# EAGLE design CCM_0020_revC (EAGLE 9.5.1)

## Sheet 1 of 4: transmitter
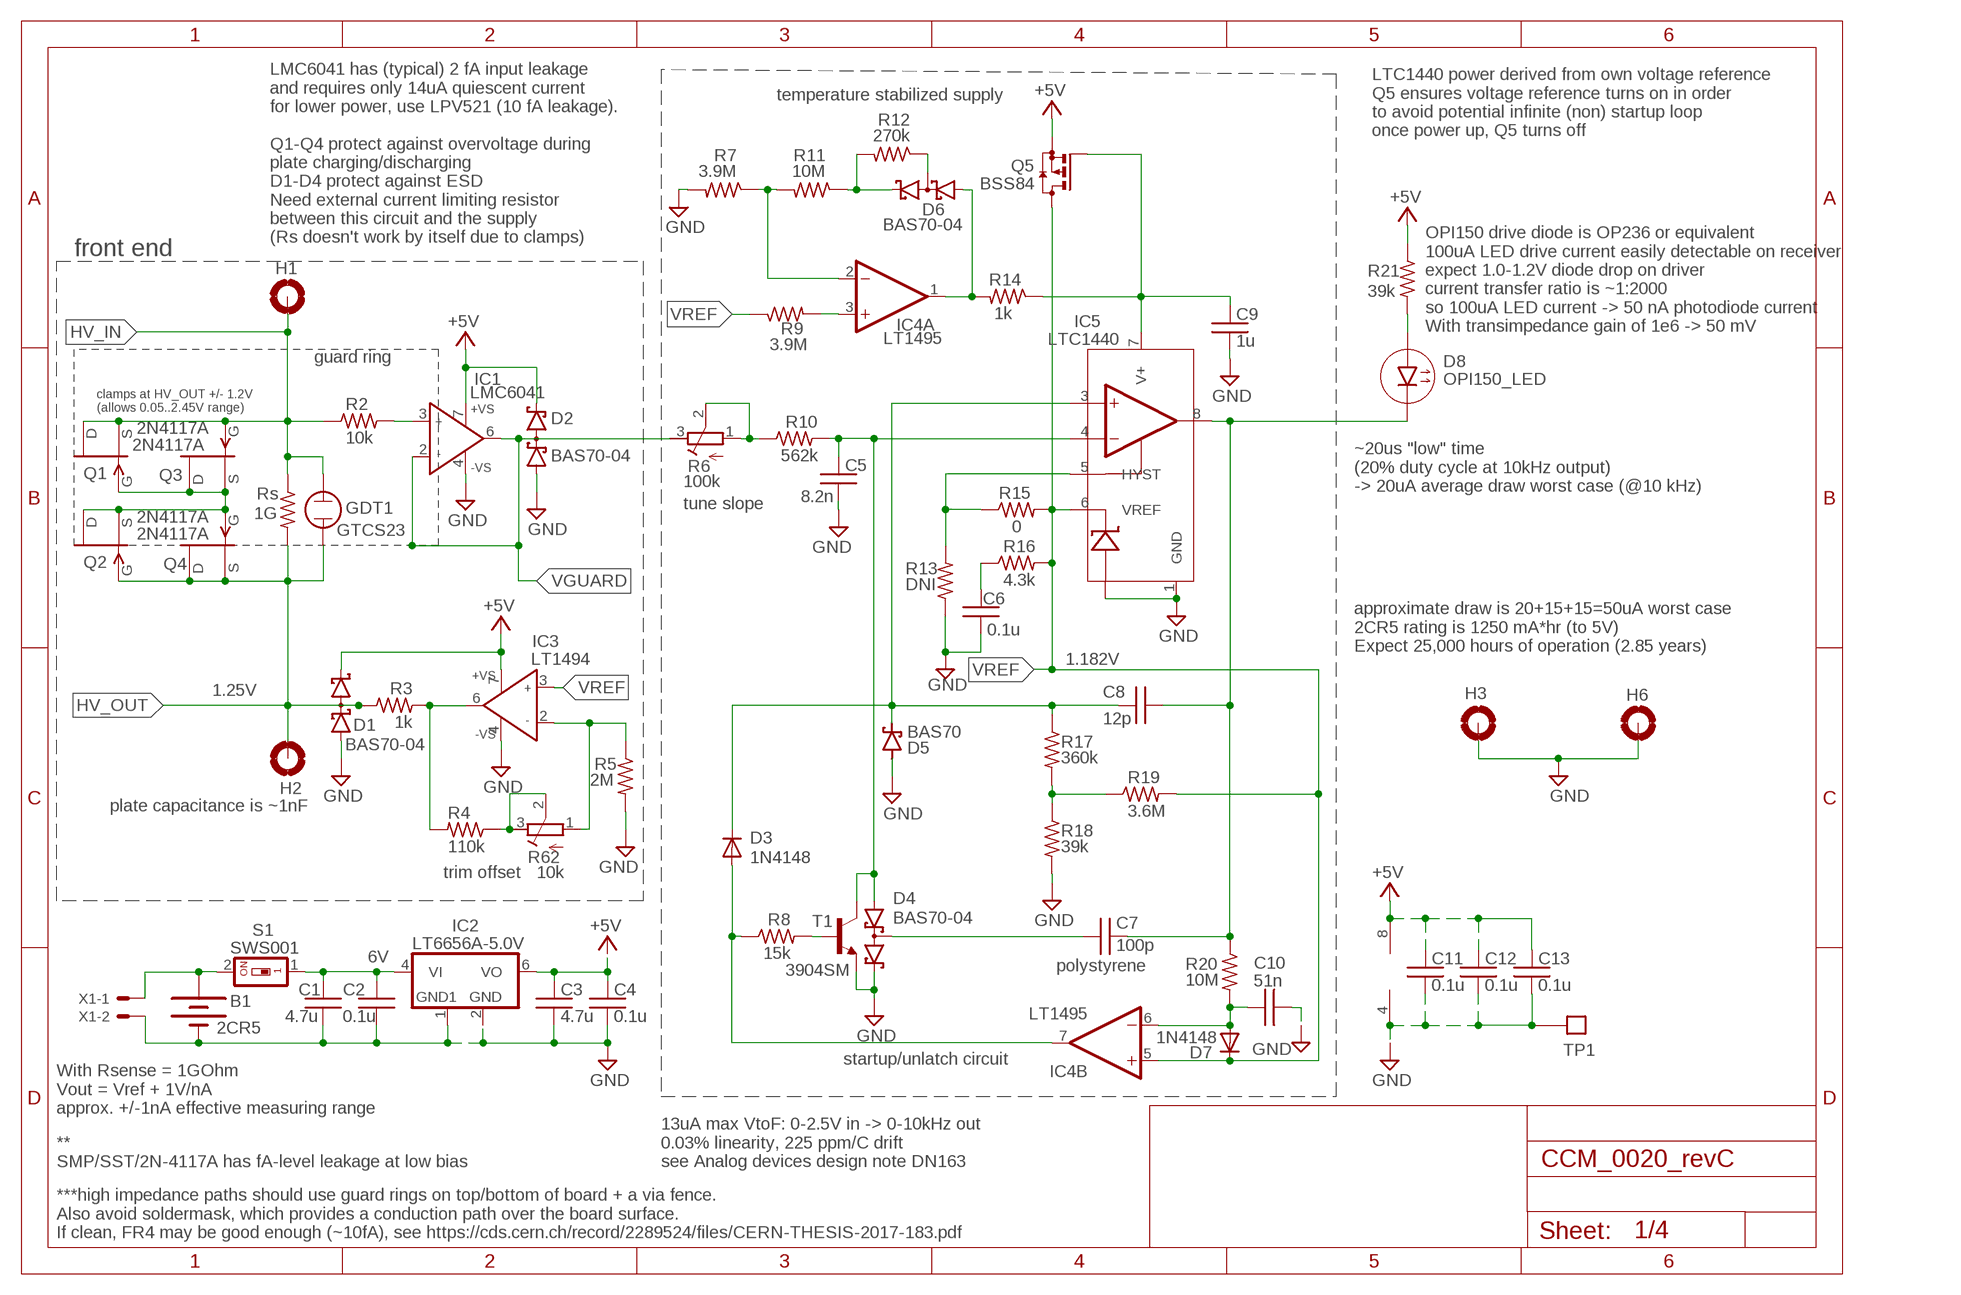
[diagram p0: schematic, sheet 1]

### Parts
B1  2CR5  BATTERY  [2CR5]
C1  4.7u  C0603  [0603]
C2  0.1u  C0603  [0603]
C3  4.7u  C0603  [0603]
C4  0.1u  C0603  [0603]
C5  8.2n  C0603  [0603]
C6  0.1u  C0603  [0603]
C7  100p  C0603  [0603]
C8  12p  C0603  [0603]
C9  1u  C0603  [0603]
C10  51n  C0603  [0603]
C11  0.1u  C0603  [0603]
C12  0.1u  C0603  [0603]
C13  0.1u  C0603  [0603]
D1  BAS70-04  [SOT23]
D2  BAS70-04  [SOT23]
D3  1N4148  [SOD323_ST]
D4  BAS70-04  [SOT23]
D5  BAS70  BAT60J  [SOD323_ST]
D6  BAS70-04  [SOT23]
D7  1N4148  [SOD323_ST]
D8  OPI150_LED  [OPI150_LED]
GDT1  GTCS23  [GTCS23]
H1  MOUNT-PAD-ROUND3.0  [3,0-PAD]
H2  MOUNT-PAD-ROUND3.0  [3,0-PAD]
H3  MOUNT-PAD-ROUND3.0  [3,0-PAD]
H6  MOUNT-PAD-ROUND3.0  [3,0-PAD]
IC1  LMC6041  AD825_A  [SO8]
IC2  LT6656A-5.0V  LT6656  [SOT23-6]
IC3  LT1494  AD825_A  [SO8]
IC4  LT1495  LT1495D  [SO8]
IC5  LTC1440  [SO8]
Q1  2N4117A  SST5484  [SOT23]
Q2  2N4117A  SST5484  [SOT23]
Q3  2N4117A  SST5484  [SOT23]
Q4  2N4117A  SST5484  [SOT23]
Q5  BSS84  [SOT23]
R1  1G  RESISTOR2512  [2512]
R2  10k  R0603  [0603]
R3  1k  R0603  [0603]
R4  110k  R0603  [0603]
R5  2M  R0603  [0603]
R6  100k  R-TRIMM3224W  [RTRIM3224W]
R7  3.9M  R0603  [0603]
R8  15k  R0603  [0603]
R9  3.9M  R0603  [0603]
R10  562k  R0603  [0603]
R11  10M  R0603  [0603]
R12  270k  R0603  [0603]
R13  DNI  R0603  [0603]
R14  1k  R0603  [0603]
R15  0  R0603  [0603]
R16  4.3k  R0603  [0603]
R17  360k  R0603  [0603]
R18  39k  R0603  [0603]
R19  3.6M  R0603  [0603]
R20  10M  R0603  [0603]
R21  39k  R0603  [0603]
R62  10k  R-TRIMM3224W  [RTRIM3224W]
S1  SWS001  [SMS-001]
T1  3904SM  [SOT23]
TP1  TESTPOINT  [TESTPOINT]
X1  22-23-2021  [22-23-2021]

### Nets
+5V: C3.1 C4.1 C11.1 C12.1 C13.1 D1.2(C2) D2.2(C2) IC1.7(+VS) IC2.6(VO) IC3.7(+VS) IC4.8(P:V+) Q5.2(S) R21.1
GND: B1.V-(-) C1.2 C2.2 C3.2 C4.2 C5.2 C6.1 C9.2 C10.2 C11.2 C12.2 C13.2 D1.1(A1) D2.1(A1) D4.2(C2) D5.A H3.B3,0(MOUNT) H6.B3,0(MOUNT) IC1.4(-VS) IC2.1(GND1) IC2.2(GND) IC3.4(-VS) IC4.4(P:V-) IC5.1(GND) IC5.2(V-) R5.2 R7.2 R13.1 R18.2 T1.2(E) TP1.P$1 X1.2
HV_IN: GDT1.P$1 H1.B3,0(MOUNT) Q1.1(D) Q1.2(S) Q3.3(G) R1.1 R2.1
HV_IN1: Q1.3(G) Q2.1(D) Q2.2(S) Q3.1(D) Q3.2(S) Q4.3(G)
HV_OUT: D1.3(C1A2) GDT1.P$2 H2.B3,0(MOUNT) Q2.3(G) Q4.1(D) Q4.2(S) R1.2 R3.1
HYST: IC5.5(HYST) R13.2 R15.1
N$2: C9.1 IC5.7(V+) Q5.1(G) R14.1
N$3: D8.P$1(1(A)) R21.2
N$6: R6.1(A) R6.2(S) R10.1
N$7: IC1.3(IN+) R2.2
N$9: C6.2 R16.1
N$10: C5.1 D4.1(A1) IC5.4(-IN) R10.2 T1.3(C)
N$11: C7.1 D4.3(C1A2)
N$12: R8.2 T1.1(B)
N$13: D3.A IC4.7(B:OUT) R8.1
N$14: R17.2 R18.1 R19.1
N$15: C8.1 D3.C D5.C IC5.3(+IN) R17.1
N$16: C10.1 D7.A IC4.6(B:-IN) R20.2
N$18: D6.1(A1) IC4.1(A:OUT) R14.2
N$19: D6.2(C2) R11.1 R12.2
N$20: IC4.2(A:-IN) R7.1 R11.2
N$22: C1.1 C2.1 IC2.4(VI) S1.1
N$23: D6.3(C1A2) R12.1
N$25: IC4.3(A:+IN) R9.2
N$27: IC3.2(IN-) R5.1 R62.1(A)
N$28: IC3.6(OUT) R3.2 R4.2
N$34: R4.1 R62.2(S) R62.3(E)
N$63: B1.V+(+) S1.2 X1.1
VGUARD: D2.3(C1A2) IC1.2(IN-) IC1.6(OUT) R6.3(E)
VREF: D7.C IC3.3(IN+) IC4.5(B:+IN) IC5.6(VREF) Q5.3(D) R9.1 R15.2 R16.2 R19.2
VTOF_OUTPUT: C7.2 C8.2 D8.P$2(2(C)) IC5.8(OUT) R20.1

### Notes on the sheet
- temperature stabilized supply
- LTC1440 power derived from own voltage reference
  Q5 ensures voltage reference turns on in order
  to avoid potential infinite (non) startup loop
  once power up, Q5 turns off
- LMC6041 has (typical) 2 fA input leakage
  and requires only 14uA quiescent current
  for lower power, use LPV521 (10 fA leakage).
  
  Q1-Q4 protect against overvoltage during 
  plate charging/discharging  
  D1-D4 protect against ESD
  Need external current limiting resistor
  between this circuit and the supply
  (Rs doesn't work by itself due to clamps)
- front end
- OPI150 drive diode is OP236 or equivalent
  100uA LED drive current easily detectable on receiver
  expect 1.0-1.2V diode drop on driver
  current transfer ratio is ~1:2000
  so 100uA LED current -> 50 nA photodiode current
  With transimpedance gain of 1e6 -> 50 mV
- guard ring
- clamps at HV_OUT +/- 1.2V
  (allows 0.05..2.45V range)
- ~20us "low" time
  (20% duty cycle at 10kHz output)
  -> 20uA average draw worst case (@10 kHz)
- Rs
- tune slope
- approximate draw is 20+15+15=50uA worst case
  2CR5 rating is 1250 mA*hr (to 5V)
  Expect 25,000 hours of operation (2.85 years)
- 1.182V
- 1.25V
- plate capacitance is ~1nF
- trim offset
- 6V
- polystyrene
- startup/unlatch circuit
- With Rsense = 1GOhm
  Vout = Vref + 1V/nA
  approx. +/-1nA effective measuring range
- **
  SMP/SST/2N-4117A has fA-level leakage at low bias
- 13uA max VtoF: 0-2.5V in -> 0-10kHz out
  0.03% linearity, 225 ppm/C drift
  see Analog devices design note DN163
- ***high impedance paths should use guard rings on top/bottom of board + a via fence.  
  Also avoid soldermask, which provides a conduction path over the board surface.
  If clean, FR4 may be good enough (~10fA), see https://cds.cern.ch/record/2289524/files/CERN-THESIS-2017-183.pdf

## Sheet 2 of 4: receiver
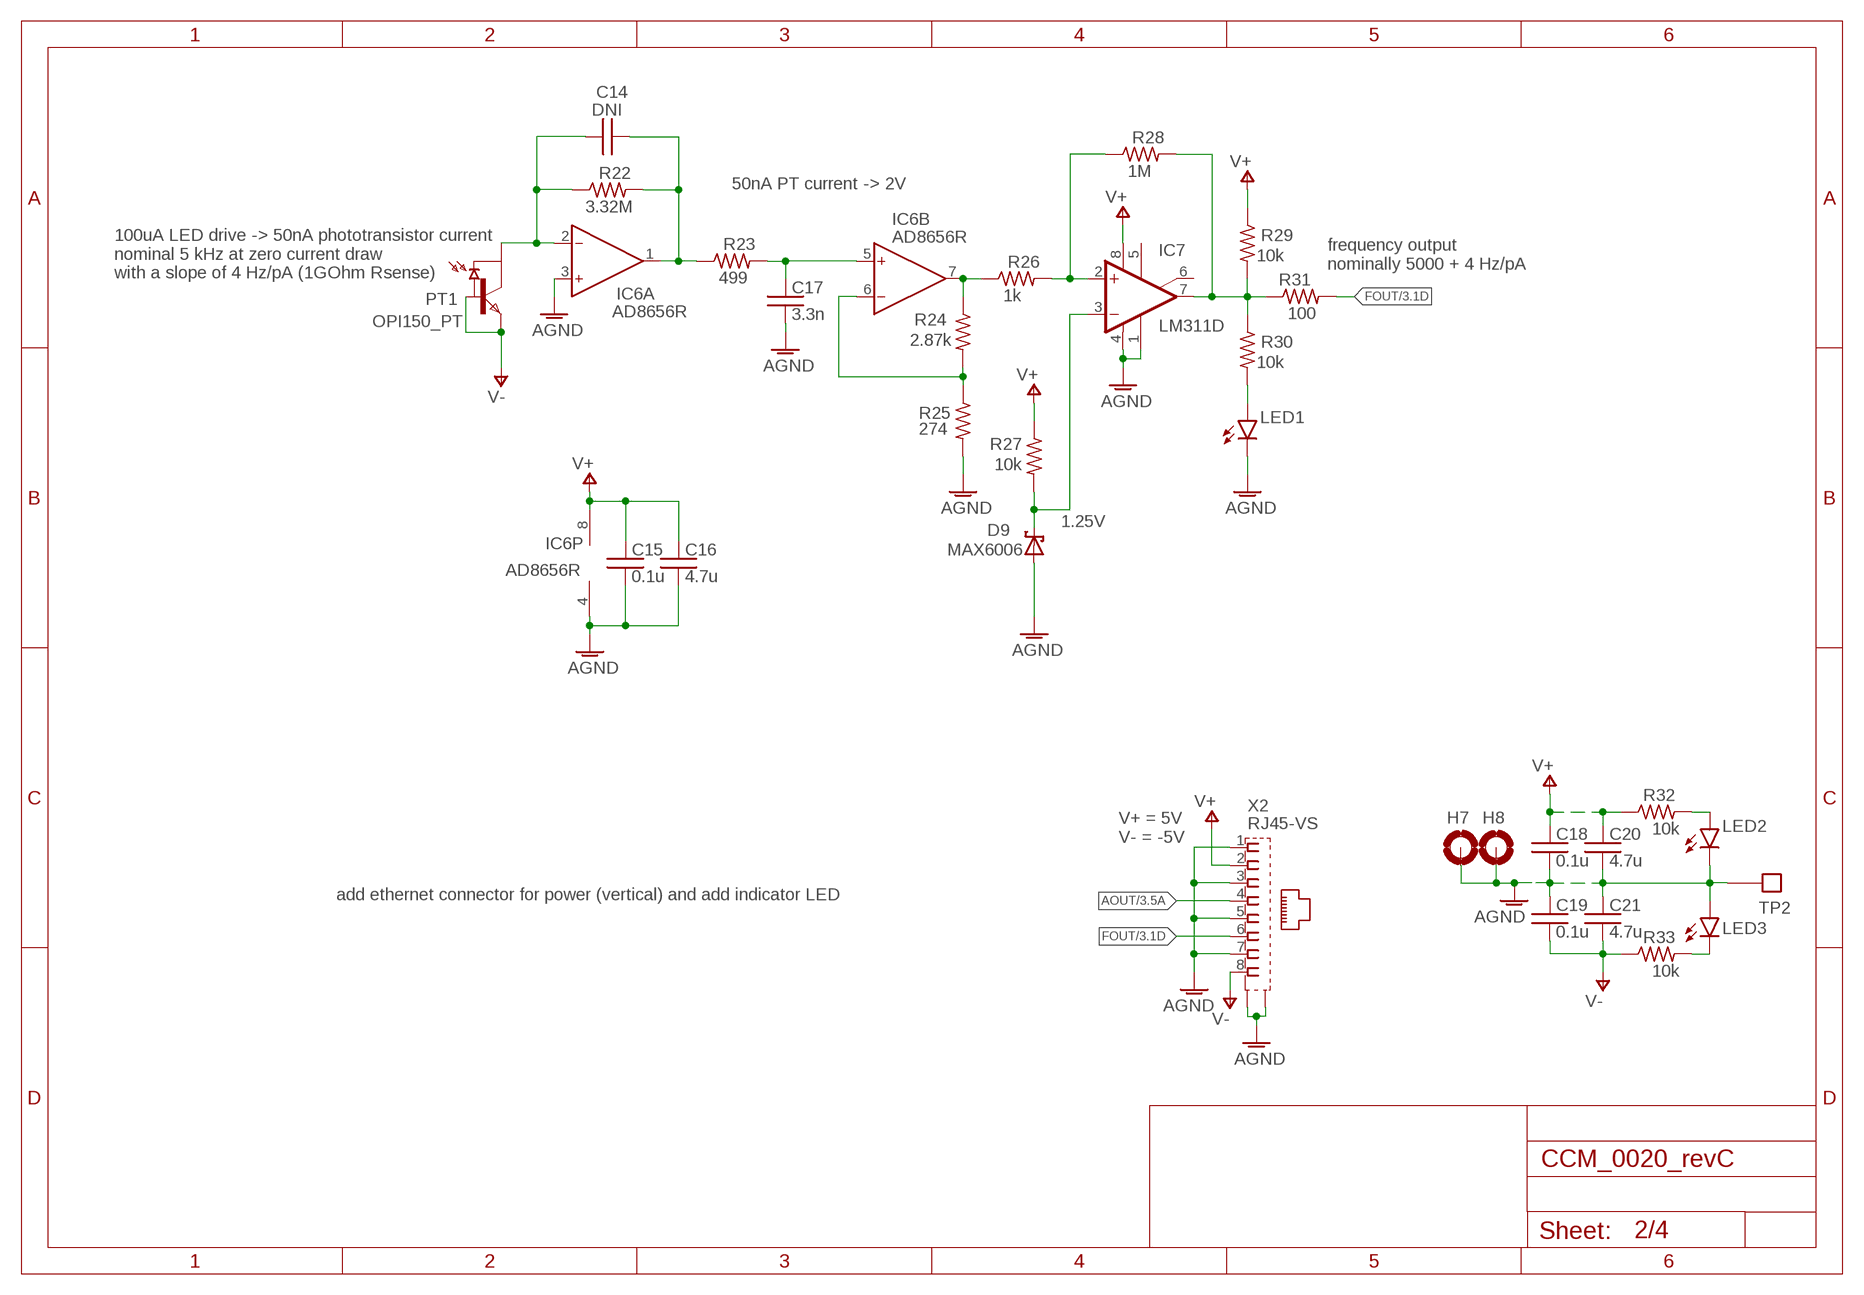
[diagram p1: schematic, sheet 2]

### Parts
C14  DNI  C0603  [0603]
C15  0.1u  C0603  [0603]
C16  4.7u  C0603  [0603]
C17  3.3n  C0603  [0603]
C18  0.1u  C0603  [0603]
C19  0.1u  C0603  [0603]
C20  4.7u  C0603  [0603]
C21  4.7u  C0603  [0603]
D9  MAX6006  LM4040  [SOT23]
H7  MOUNT-PAD-ROUND3.0  [3,0-PAD]
H8  MOUNT-PAD-ROUND3.0  [3,0-PAD]
IC6  AD8656R  [SO8]
IC7  LM311D  [SO08]
LED1  LEDCHIP-LED0603  [CHIP-LED0603]
LED2  LEDCHIP-LED0603  [CHIP-LED0603]
LED3  LEDCHIP-LED0603  [CHIP-LED0603]
PT1  OPI150_PT  OPI150_PHOTOTRANSISTOR  [OPI150_PHOTOTRANSISTOR]
R22  3.32M  R0603  [0603]
R23  499  R0603  [0603]
R24  2.87k  R0603  [0603]
R25  274  R0603  [0603]
R26  1k  R0603  [0603]
R27  10k  R0603  [0603]
R28  1M  R0603  [0603]
R29  10k  R0603  [0603]
R30  10k  R0603  [0603]
R31  100  R0603  [0603]
R32  10k  R0603  [0603]
R33  10k  R0603  [0603]
TP2  TESTPOINT  [TESTPOINT]
X2  RJ45-VS  [RJ45-VS]

### Nets
AGND: C15.2 C16.2 C17.2 C18.2 C19.1 C20.2 C21.1 D9.2(A) H7.B3,0(MOUNT) H8.B3,0(MOUNT) IC6.3(A:IN+) IC6.4(P:V-) IC7.1(GND) IC7.4(V-) LED1.C LED2.C LED3.A R25.2 TP2.P$1 X2.1 X2.3 X2.5 X2.7 X2.S1 X2.S2 ; also sheet 3
AOUT: X2.4 ; also sheet 3
FOUT: R31.2 X2.6 ; also sheet 3
N$1: LED2.A R32.2
N$4: C14.1 IC6.2(A:IN-) PT1.P3(COLLECTOR) R22.1
N$5: C14.2 IC6.1(A:OUT) R22.2 R23.1
N$8: C17.1 IC6.5(B:IN+) R23.2
N$17: IC6.6(B:IN-) R24.2 R25.1
N$21: IC6.7(B:OUT) R24.1 R26.1
N$24: IC7.2(+IN) R26.2 R28.1
N$26: D9.1(C) IC7.3(-IN) R27.2
N$54: LED3.C R33.2
N$61: LED1.A R30.2
N$100: IC7.7(OUT) R28.2 R29.2 R30.1 R31.1
V+: C15.1 C16.1 C18.1 C20.1 IC6.8(P:V+) IC7.8(V+) R27.1 R29.1 R32.1 X2.2 ; also sheet 3
V-: C19.2 C21.2 PT1.P4(BASE) PT1.P5(EMITTER) R33.1 X2.8 ; also sheet 3
Unconnected: IC7.5(ON) IC7.6(ON/STR)

### Notes on the sheet
- 50nA PT current -> 2V
- frequency output
  nominally 5000 + 4 Hz/pA
- 100uA LED drive -> 50nA phototransistor current
  nominal 5 kHz at zero current draw
  with a slope of 4 Hz/pA (1GOhm Rsense)
- 1.25V
- V+ = 5V
  V- = -5V
- add ethernet connector for power (vertical) and add indicator LED

## Sheet 3 of 4: receiver F-to-V
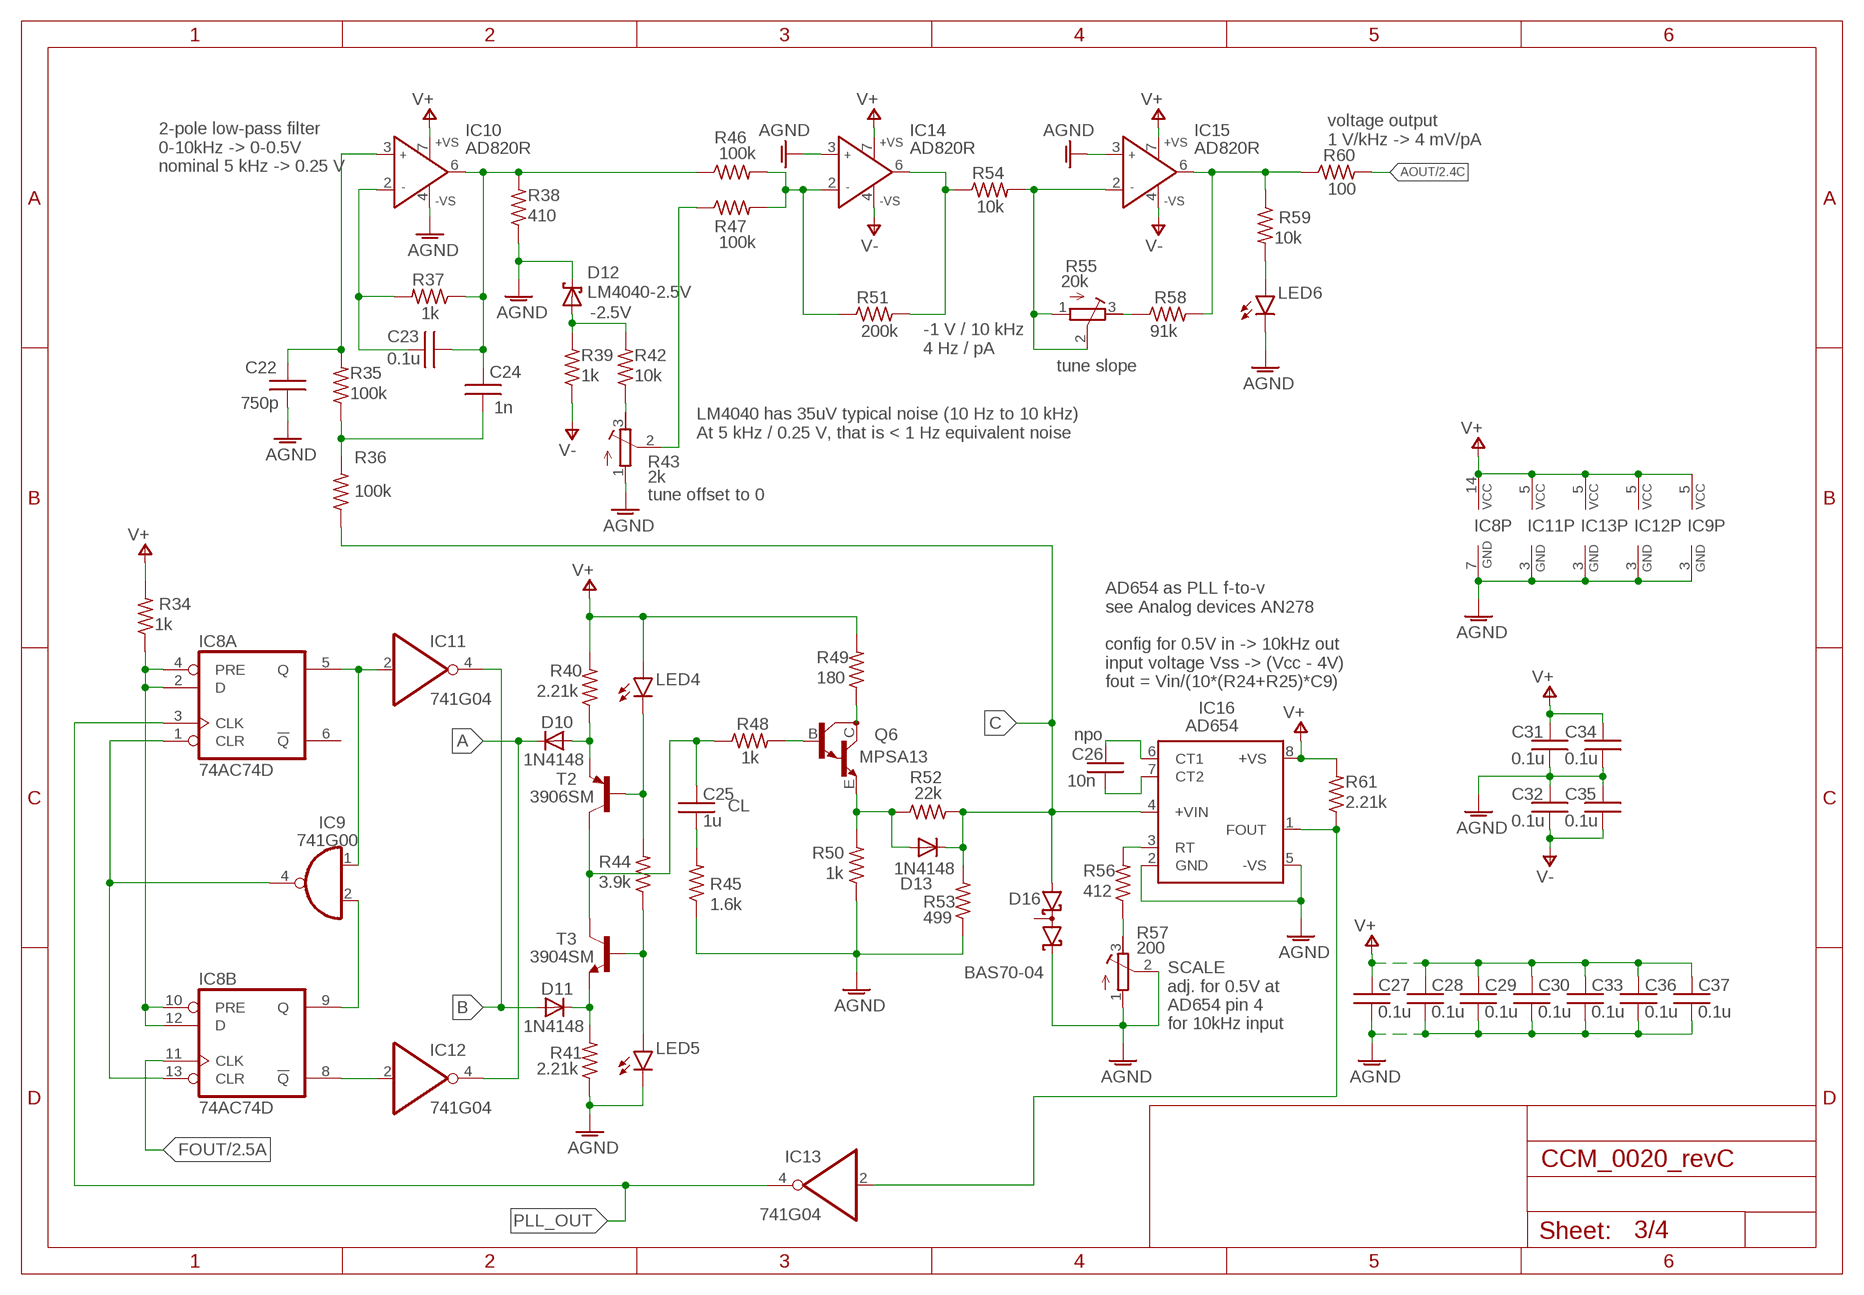
[diagram p2: schematic, sheet 3]

### Parts
C22  750p  C0603  [0603]
C23  0.1u  C0603  [0603]
C24  1n  C0603  [0603]
C25  1u  C0603  [0603]
C26  10n  C0603  [0603]
C27  0.1u  C0603  [0603]
C28  0.1u  C0603  [0603]
C29  0.1u  C0603  [0603]
C30  0.1u  C0603  [0603]
C31  0.1u  C0603  [0603]
C32  0.1u  C0603  [0603]
C33  0.1u  C0603  [0603]
C34  0.1u  C0603  [0603]
C35  0.1u  C0603  [0603]
C36  0.1u  C0603  [0603]
C37  0.1u  C0603  [0603]
D10  1N4148  [SOD323_ST]
D11  1N4148  [SOD323_ST]
D12  LM4040-2.5V  LM4040  [SOT23]
D13  1N4148  [SOD323_ST]
D16  BAS70-04  [SOT23]
IC8  74AC74D  [SO14]
IC9  741G00  74AHC1G00DBV  [SOT23-5]
IC10  AD820R  [SO8]
IC11  741G04  74AHC1G04DBV  [SOT23-5]
IC12  741G04  74AHC1G04DBV  [SOT23-5]
IC13  741G04  74AHC1G04DBV  [SOT23-5]
IC14  AD820R  [SO8]
IC15  AD820R  [SO8]
IC16  AD654  [SO08]
LED4  LEDCHIP-LED0603  [CHIP-LED0603]
LED5  LEDCHIP-LED0603  [CHIP-LED0603]
LED6  LEDCHIP-LED0603  [CHIP-LED0603]
Q6  MPSA13  MMBTA13LT1  [SOT23-BEC]
R34  1k  R0603  [0603]
R35  100k  R0603  [0603]
R36  100k  R0603  [0603]
R37  1k  R0603  [0603]
R38  410  R0603  [0603]
R39  1k  R0603  [0603]
R40  2.21k  R0603  [0603]
R41  2.21k  R0603  [0603]
R42  10k  R0603  [0603]
R43  2k  R-TRIMM3224W  [RTRIM3224W]
R44  3.9k  R0603  [0603]
R45  1.6k  R0603  [0603]
R46  100k  R0603  [0603]
R47  100k  R0603  [0603]
R48  1k  R0603  [0603]
R49  180  R0603  [0603]
R50  1k  R0603  [0603]
R51  200k  R0603  [0603]
R52  22k  R0603  [0603]
R53  499  R0603  [0603]
R54  10k  R0603  [0603]
R55  20k  R-TRIMM3224W  [RTRIM3224W]
R56  412  R0603  [0603]
R57  200  R-TRIMM3224W  [RTRIM3224W]
R58  91k  R0603  [0603]
R59  10k  R0603  [0603]
R60  100  R0603  [0603]
R61  2.21k  R0603  [0603]
T2  3906SM  MMBT3906LT1-PNP-SOT23-BEC  [SOT23-BEC]
T3  3904SM  [SOT23]

### Nets
A: D10.C IC12.4(O)
AGND: C22.1 C27.2 C28.2 C29.2 C30.2 C31.1 C32.2 C33.2 C34.1 C35.2 C36.2 C37.2 D12.1(C) D16.2(C2) IC8.7(P:GND) IC9.3(GND) IC10.4(-VS) IC11.3(GND) IC12.3(GND) IC13.3(GND) IC14.3(IN+) IC15.3(IN+) IC16.2(GND) IC16.5(-VS) LED5.C LED6.C R38.1 R41.1 R43.1(A) R45.1 R50.1 R53.1 R57.1(A) R57.2(S) ; also sheet 2
AOUT: R60.2 ; also sheet 2
B: D11.A IC11.4(O)
C: D13.C D16.1(A1) IC16.4(+VIN) R36.1 R52.2 R53.2
FOUT: IC8.11(B:CLK) ; also sheet 2
N$29: IC8.1(A:CLR) IC8.13(B:CLR) IC9.4(O)
N$30: IC8.9(B:Q) IC9.2(I1)
N$31: IC8.8(B:!Q) IC12.2(I)
N$32: IC8.5(A:Q) IC9.1(I0) IC11.2(I)
N$33: R56.1 R57.3(E)
N$35: C25.1 R48.1 T2.C T3.3(C)
N$36: D11.C R41.2 T3.2(E)
N$37: LED4.C R44.2 T2.B
N$38: LED5.A R44.1 T3.1(B)
N$39: C25.2 R45.2
N$40: Q6.C R49.1
N$41: Q6.B R48.2
N$42: D13.A Q6.E R50.2 R52.1
N$43: IC16.3(RT) R56.2
N$44: C26.1 IC16.6(CT1)
N$45: C26.2 IC16.7(CT2)
N$46: IC13.2(I) IC16.1(FOUT) R61.1
N$47: C24.1 R35.1 R36.2
N$48: C22.2 IC10.3(IN+) R35.2
N$49: C23.2 C24.2 IC10.6(OUT) R37.1 R38.2 R46.1
N$50: C23.1 IC10.2(IN-) R37.2
N$51: IC14.2(IN-) R46.2 R47.2 R51.1
N$52: IC15.2(IN-) R54.2 R55.1(A) R55.2(S)
N$53: IC15.6(OUT) R58.2 R59.1 R60.1
N$55: IC14.6(OUT) R51.2 R54.1
N$56: D12.2(A) R39.2 R42.2
N$57: R43.2(S) R47.1
N$58: R42.1 R43.3(E)
N$59: R55.3(E) R58.1
N$60: D10.A R40.1 T2.E
N$62: LED6.A R59.2
N$69: IC8.2(A:D) IC8.4(A:PRE) IC8.10(B:PRE) IC8.12(B:D) R34.1
PLL_OUT: IC8.3(A:CLK) IC13.4(O)
V+: C27.1 C28.1 C29.1 C30.1 C31.2 C33.1 C34.2 C36.1 C37.1 IC8.14(P:VCC) IC9.5(VCC) IC10.7(+VS) IC11.5(VCC) IC12.5(VCC) IC13.5(VCC) IC14.7(+VS) IC15.7(+VS) IC16.8(+VS) LED4.A R34.2 R40.2 R49.2 R61.2 ; also sheet 2
V-: C32.1 C35.1 IC14.4(-VS) IC15.4(-VS) R39.1 ; also sheet 2
Unconnected: D16.3(C1A2) IC8.6(A:!Q)

### Notes on the sheet
- voltage output
  1 V/kHz -> 4 mV/pA
- 2-pole low-pass filter
  0-10kHz -> 0-0.5V
  nominal 5 kHz -> 0.25 V
- -2.5V
- -1 V / 10 kHz
  4 Hz / pA
- tune slope
- LM4040 has 35uV typical noise (10 Hz to 10 kHz)
  At 5 kHz / 0.25 V, that is < 1 Hz equivalent noise
- tune offset to 0
- AD654 as PLL f-to-v
  see Analog devices AN278
  
  config for 0.5V in -> 10kHz out
  input voltage Vss -> (Vcc - 4V)
  fout = Vin/(10*(R24+R25)*C9)
- npo
- CL
- SCALE
  adj. for 0.5V at 
  AD654 pin 4
  for 10kHz input

## Sheet 4 of 4: host connector
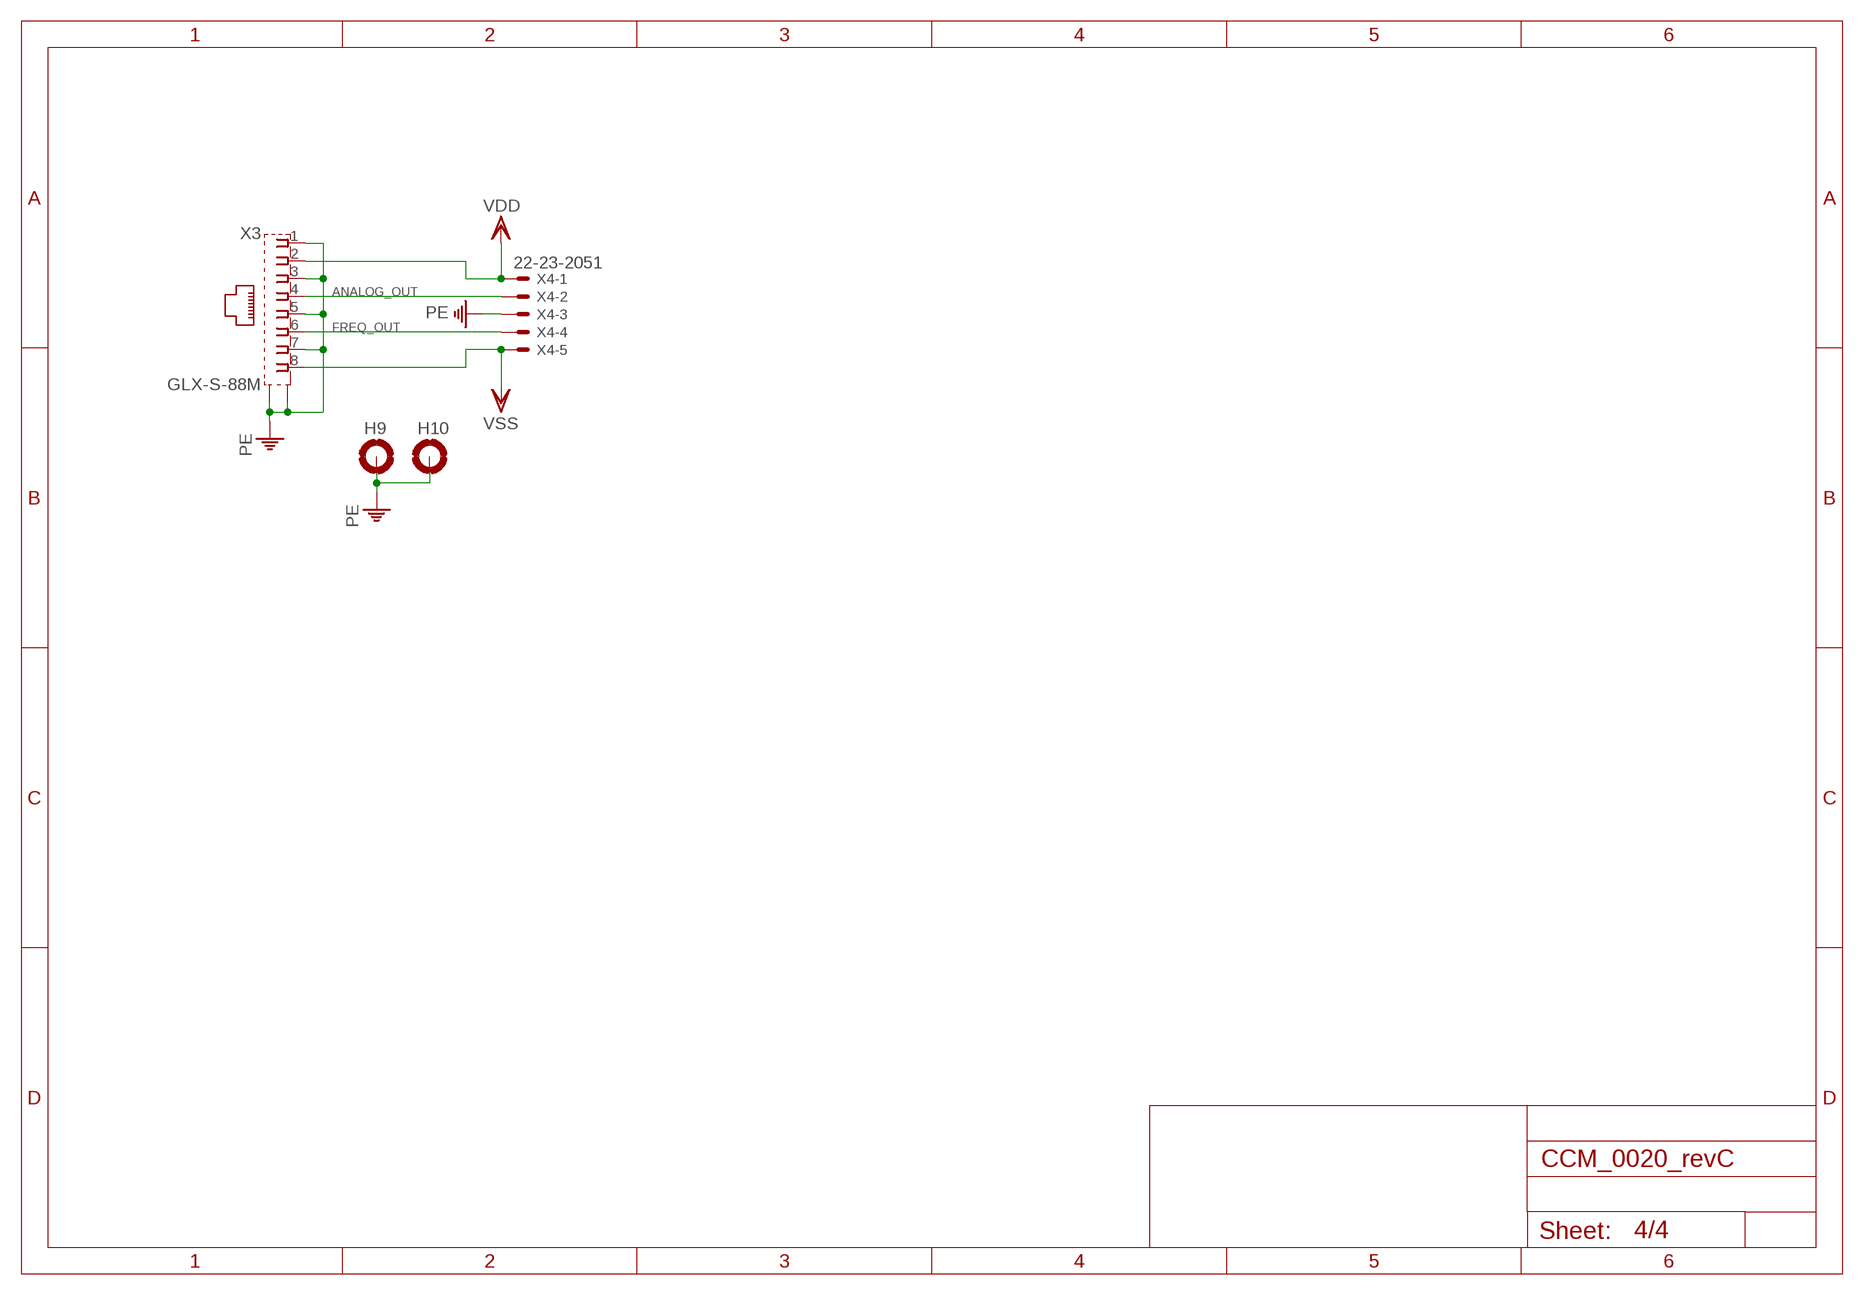
[diagram p3: schematic, sheet 4]

### Parts
H9  MOUNT-PAD-ROUND3.0  [3,0-PAD]
H10  MOUNT-PAD-ROUND3.0  [3,0-PAD]
X3  GLX-S-88M  [GLX-S-88M]
X4  22-23-2051  [22-23-2051]

### Nets
ANALOG_OUT: X3.4 X4.2
FREQ_OUT: X3.6 X4.4
PE: H9.B3,0(MOUNT) H10.B3,0(MOUNT) X3.1 X3.3 X3.5 X3.7 X3.S1 X3.S2 X4.3
VDD: X3.2 X4.1
VSS: X3.8 X4.5

## Library data of the parts
B1 = noah:BATTERY
C1-C37 = acrooptics:C: Capacitor
D1 D2 D4 D6 D16 = diode:BAS70-04: Silicon Schottky Diodes General-purpose diode for high-speed switching
D3 D7 D10 D11 D13 = custom_parts:1N4148: DIODE high speed (Philips)
D5 = diode:BAT60J: Schottky barrier diode Source: www.st.com, BAT60J.pdf
D8 = noah:OPI150_LED
D9 D12 = noah:LM4040: LM4040 Reference Zener Diode
GDT1 = noah:GTCS23
H1-H3 H6-H10 = holes:MOUNT-PAD-ROUND: MOUNTING PAD, round
IC1 IC3 = noah:AD825_A: Low Cost, General-Purpose High Speed JFET Amplifier Source: http://www.analog.com/static/imported-files/data_sheets/AD825.pdf
IC2 = noah:LT6656
IC4 = noah:LT1495: COMPARATOR
IC5 = noah:LTC1440
IC6 = noah:AD8656: Low Noise, Precision CMOS Amplifier Source: http://www.analog.com/static/imported-files/data_sheets/AD8655_8656.pdf; MPN: AD8656ARZ; OC_FARNELL: 1117887; OC_NEWARK: 19M0993
IC7 = noah:LM311: COMPARATOR
IC8 = noah:74*74: Dual D type positive edge triggered FLIP FLOP, preset and clear
IC9 = 74xx-little-de:74*1G00: 2-input NAND gate
IC10 IC14 IC15 = noah:AD820: Single-Supply, Rail-to-Rail, Low Power, FET Input Op Amp Source: http://www.analog.com/static/imported-files/data_sheets/AD820.pdf; OC_FARNELL: 1838867; OC_NEWARK: unknown
IC11-IC13 = 74xx-little-de:74*1G04: INVERTER Gate
IC16 = noah:AD654: Low Cost Monolithic Voltage-to-Frequency Converter
LED1-LED6 = led:LED: LED OSRAM: - CHIPLED LG R971, LG N971, LY N971, LG Q971, LY Q971, LO R971, LY R971 LH N974, LH R974 LS Q976, LO Q976, LY Q976 LO Q996 - Hyper CHIPLED LW Q18S LB Q993, LB Q99A, LB R99A - SideLED LS A670, LO A670, LY A670, LG A670, LP A670 LB A673, LV A673, LT A673, LW A673 LH A674 LY A675 LS A676, LA A676, LO A676, LY A676, LW A676 LS A679, LY A679, LG A679 - Hyper Micro SIDELED® LS Y876, LA Y876, LO Y876, LY Y876 LT Y87S - SmartLED LW L88C, LW L88S LB L89C, LB L89S, LG L890 LS L89K, LO L89K, LY L89K LS L896, LA L896, LO L896, LY L896 - TOPLED LS T670, LO T670, LY T670, LG T670, LP T670 LSG T670, LSP T670, LSY T670, LOP T670, LYG T670 LG T671, LOG T671, LSG T671 LB T673, LV T673, LT T673, LW T673 LH T674 LS T676, LA T676, LO T676, LY T676, LB T676, LH T676, LSB T676, LW T676 LB T67C, LV T67C, LT T67C, LS T67K, LO T67K, LY T67K, LW E67C LS E67B, LA E67B, LO E67B, LY E67B, LB E67C, LV E67C, LT E67C LW T67C LS T679, LY T679, LG T679 LS T770, LO T770, LY T770, LG T770, LP T770 LB T773, LV T773, LT T773, LW T773 LH T774 LS E675, LA E675, LY E675, LS T675 LS T776, LA T776, LO T776, LY T776, LB T776 LHGB T686 LT T68C, LB T68C - Hyper Mini TOPLED® LB M676 - Mini TOPLED Santana® LG M470 LS M47K, LO M47K, LY M47K Source: http://www.osram.convergy.de LUXEON: - LUMILED® LXK2-PW12-R00, LXK2-PW12-S00, LXK2-PW14-U00, LXK2-PW14-V00 LXK2-PM12-R00, LXK2-PM12-S00, LXK2-PM14-U00 LXK2-PE12-Q00, LXK2-PE12-R00, LXK2-PE12-S00, LXK2-PE14-T00, LXK2-PE14-U00 LXK2-PB12-K00, LXK2-PB12-L00, LXK2-PB12-M00, LXK2-PB14-N00, LXK2-PB14-P00, LXK2-PB14-Q00 LXK2-PR12-L00, LXK2-PR12-M00, LXK2-PR14-Q00, LXK2-PR14-R00 LXK2-PD12-Q00, LXK2-PD12-R00, LXK2-PD12-S00 LXK2-PH12-R00, LXK2-PH12-S00 LXK2-PL12-P00, LXK2-PL12-Q00, LXK2-PL12-R00 Source: www.luxeon.com KINGBRIGHT: KA-3528ASYC Source: www.kingbright.com
PT1 = noah:OPI150_PHOTOTRANSISTOR
Q1-Q4 = transistor-fet:?548*: N-Channel JFETs Source: VISHAY 2N5484.pdf Compatible: TO92 2N5245 J304 J305 U310 J308 J309 J310 TO72 2N4416 2N4416A 2N3823 2N4351 3N169 3N170 3N171 MFE3002 TO18 2N3796 2N3797 MFE825 Source: Motorola European Master Guide Pacge 3-59
Q5 = transistor-small-signal:BSS84: P-CHANNEL MOS FET
Q6 = transistor-npn:MMBTA13*: NPN Darlington Transistor
R1 = noah:RESISTOR: RESISTOR, American symbol
R2-R5 R7-R42 R44-R54 R56 R58-R61 = acrooptics:R: 0603 resistor
R6 R43 R55 R57 R62 = rcl:R-TRIMM: Trimm resistor; SPICEMODEL: X; SPICEPREFIXL: POT
S1 = smd-special:SWS001: SMD Dip Switch 1 pol.
T1 T3 = noah:3904: NPN TRANSISTOR
T2 = transistor:*-PNP-: PNP Transistror
TP1 TP2 = noah:TESTPOINT
X1 = con-molex:22-23-2021: .100" (2.54mm) Center Header - 2 Pin; MF: MOLEX; MPN: 22-23-2021; OC_FARNELL: 1462926; OC_NEWARK: 25C3832
X2 = noah:RJ45-VS
X3 = noah:GLX-S-88M: Mod. Jack, Right Angle, 8 posiotion, 8 contatcs RJ45 Source: GLX-S-88M.pdf; OC_FARNELL: unknown; OC_NEWARK: unknown
X4 = con-molex:22-23-2051: .100" (2.54mm) Center Header - 5 Pin; MF: MOLEX; MPN: 22-23-2051; OC_FARNELL: 1462952; OC_NEWARK: 38C9178

## Net classes
1 standard: width 0.61 mm, clearance 0.254 mm
2 shield: width 0.61 mm, clearance 0.635 mm

## Board
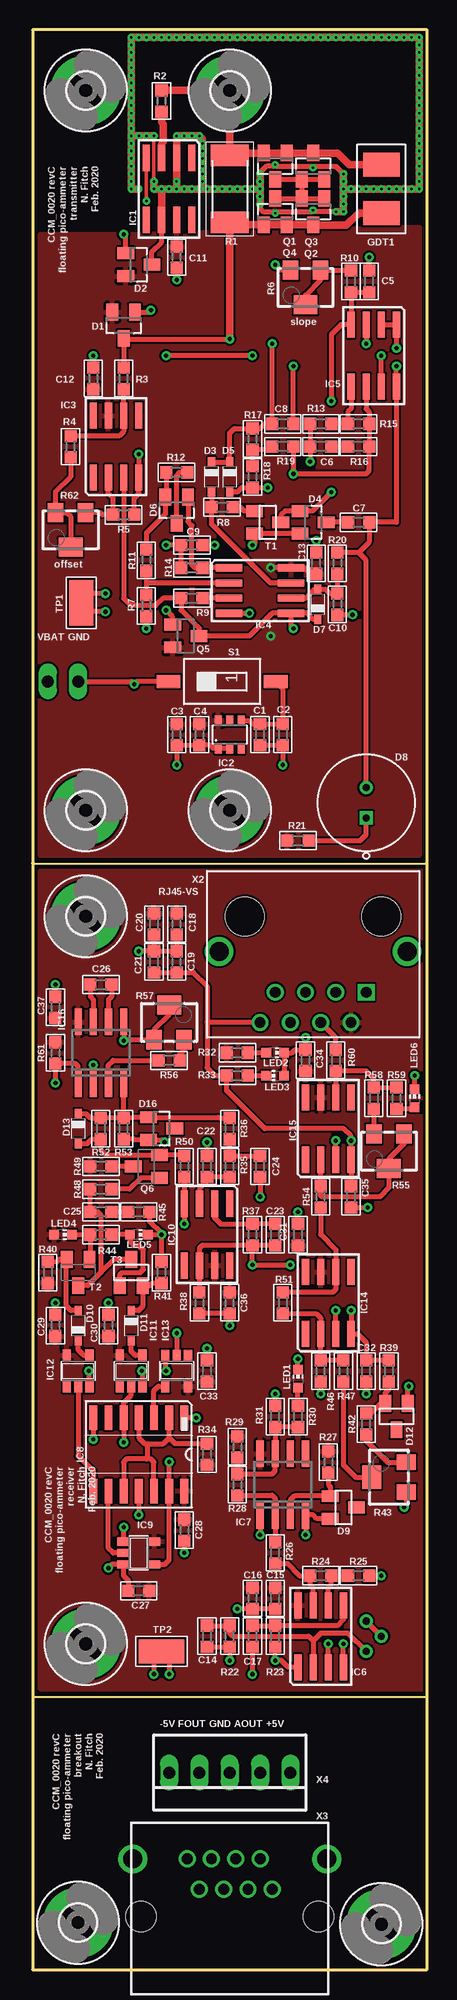
[diagram p4: board, top side]
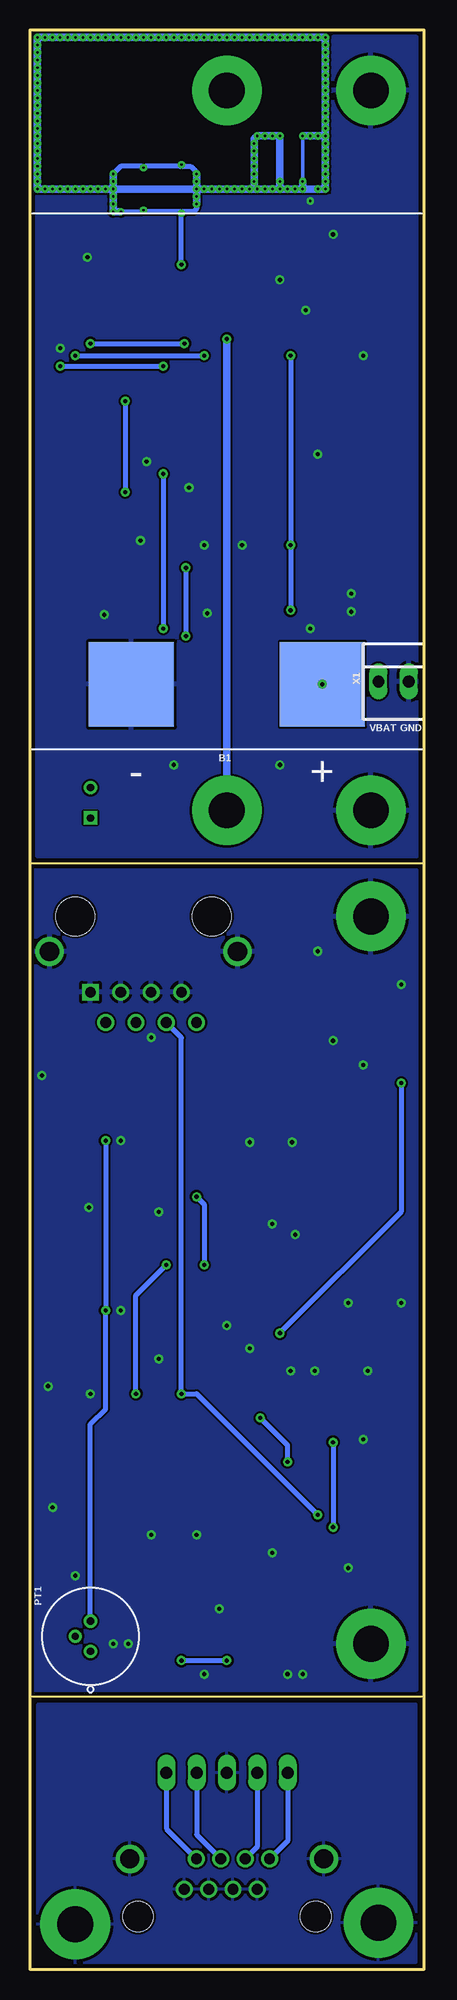
[diagram p5: board, bottom side, seen from below]

Size 33.02 x 162.56 mm. Coordinates in mm from the lower left corner, seen from the top.
Outline: 0,92.71 0,162.56 33.02,162.56 33.02,92.71
Outline: 0,92.71 0,0 33.02,0 33.02,92.71
Outline: 0,92.71 33.02,92.71
Outline: 0,22.86 33.02,22.86
Copper layers (1*16): Top 0.035mm / dielectric 1.5mm / Bottom 0.035mm
Design rules "default *": minimum track width 10mil, minimum drill 8mil, track to track 7mil, track to pad 7mil, pad to pad 7mil, via to via 7mil, smd to smd 7mil, copper to edge 8mil, drill to drill 8mil, minimum pad ring 10mil, minimum via ring 8mil, stop-mask expansion 4mil, vias tented up to drill 0mil, thermal gap 10mil

### Footprints (pad centres in the part's own frame; a part is rotated, then mirrored left to right if it is on the bottom)
2CR5 = smd 7.112 x 7.112: V+ -8,17; V- 8,17
0603 = smd 1.016 x 1.016: 1 -0.889,0; 2 0.889,0
SOT23 = smd 1 x 1.4: 1 -0.95,-1.1; 2 0.95,-1.1; 3 0,1.1
SOD323_ST = smd 0.8 x 0.6: A 1.25,0; C -1.25,0
OPI150_LED = drill 0.6 square: P$1 0,1.27 | drill 0.6: P$2 0,-1.27
GTCS23 = smd 2.032 x 3.048: P$1 -2.032,0; P$2 2.032,0
3,0-PAD = drill 3 pad 5.842: B3,0 0,0
SO8 = smd 0.6 x 2.2: 1 -1.905,-2.6; 2 -0.635,-2.6; 3 0.635,-2.6; 4 1.905,-2.6; 5 1.905,2.6; 6 0.635,2.6; 7 -0.635,2.6; 8 -1.905,2.6
SOT23-6 = smd 0.6 x 0.9: 1 -0.95,-1.15; 2 0,-1.15; 3 0.95,-1.15; 4 0.95,1.15; 5 0,1.15; 6 -0.95,1.15
SO08 = smd 0.6 x 2.2: 1 -1.905,-2.6; 2 -0.635,-2.6; 3 0.635,-2.6; 4 1.905,-2.6; 5 1.905,2.6; 6 0.635,2.6; 7 -0.635,2.6; 8 -1.905,2.6
SO14 = smd 0.66 x 2.032: 1 -3.81,-3.073; 2 -2.54,-3.073; 3 -1.27,-3.073; 4 0,-3.073; 5 1.27,-3.073; 6 2.54,-3.073; 7 3.81,-3.073; 8 3.81,3.073; 9 2.54,3.073; 10 1.27,3.073; 11 0,3.073; 12 -1.27,3.073; 13 -2.54,3.073; 14 -3.81,3.073
SOT23-5 = smd 0.69 x 0.99: 1 -0.95,-1.29; 2 0,-1.29; 3 0.95,-1.29; 4 0.95,1.3; 5 -0.95,1.3
CHIP-LED0603 = smd 0.8 x 0.8: A 0,-0.75; C 0,0.75
OPI150_PHOTOTRANSISTOR = drill 0.6: P3 0,1.27; P4 1.27,0; P5 0,-1.27
SOT23-BEC = smd 1 x 1.4: B -0.95,-1.1; C 0,1.1; E 0.95,-1.1
2512 = smd 1.8 x 3.2: 1 -2.8,0; 2 2.8,0
RTRIM3224W = smd 1.3 x 1.6: 1 -1.25,-1.45; 3 1.25,-1.45 | smd 2 x 1.6: 2 0,1.45
SMS-001 = smd 1.092 x 2.007: 1 0,-4.496; 2 0,4.496
TESTPOINT = smd 3.81 x 2.032: P$1 0,0
22-23-2021 = drill 1 long: 1 -1.27,0; 2 1.27,0
RJ45-VS = drill 0.9 square: 1 4.445,-6.35 | drill 0.9: 2 3.175,-8.89; 3 1.905,-6.35; 4 0.635,-8.89; 5 -0.635,-6.35; 6 -1.905,-8.89; 7 -3.175,-6.35; 8 -4.445,-8.89 | drill 1.6: S1 -7.875,-2.94; S2 7.875,-2.94 | hole 3.25: -5.715,0.01; 5.715,0.01
GLX-S-88M = drill 0.9 pad 1.422: 1 -3.57,-2.3; 2 -2.55,-4.84; 3 -1.53,-2.3; 4 -0.51,-4.84; 5 0.51,-2.3; 6 1.53,-4.84; 7 2.55,-2.3; 8 3.57,-4.84 | drill 1.6 pad 2.184: S1 -8.125,-4.84; S2 8.125,-4.84 | hole 2.55: -7.44,0; 7.44,0
22-23-2051 = drill 1 long: 1 -5.08,0; 2 -2.54,0; 3 0,0; 4 2.54,0; 5 5.08,0

### Placement (x,y rotation side)
B1  16.51,124.71 180 bottom
C1  19.05,103.5 270 top
C2  20.95,103.5 270 top
C3  12.06,103.5 270 top
C4  13.97,103.5 270 top
C5  28.19,141.48 90 top
C6  24.13,127.63 0 top
C7  27.3,121.28 0 top
C8  20.95,129.54 0 top
C9  13.34,119.38 0 top
C10  25.53,114.43 270 top
C11  12.06,143.51 270 top
C12  5.08,133.35 90 top
C13  23.75,117.86 90 top
C14  14.61,27.94 270 top
C15  20.32,31.11 270 top
C16  18.41,31.11 270 top
C17  18.41,27.94 270 top
C18  12.06,87.63 270 top
C19  12.06,84.45 270 top
C20  10.16,87.63 270 top
C21  10.16,84.45 270 top
C22  14.61,67.31 270 top
C23  20.32,61.59 270 top
C24  19.05,67.31 270 top
C25  5.71,63.5 0 top
C26  5.71,82.55 180 top
C27  8.89,31.75 180 top
C28  12.7,36.83 270 top
C29  1.91,53.97 90 top
C30  6.35,53.97 90 top
C31  22.23,61.59 270 top
C32  27.94,50.16 270 top
C33  14.61,50.16 90 top
C34  22.86,76.2 270 top
C35  26.67,64.77 270 top
C36  16.51,55.88 270 top
C37  1.91,80.64 90 top
D1  7.62,137.79 180 top
D2  8.89,142.88 270 top
D3  14.99,125.09 270 top
D4  23.5,121.28 270 top
D5  16.51,125.09 270 top
D6  12.06,122.3 180 top
D7  23.88,114.43 90 top
D8  27.94,97.79 180 top
D9  26.04,38.73 270 top
D10  3.81,53.97 90 top
D11  8.26,53.97 270 top
D12  30.48,46.35 180 top
D13  3.81,70.48 270 top
D16  10.79,70.48 270 top
GDT1  29.21,149.22 270 top
H1  16.51,157.48 0 top
H2  16.51,97.16 0 top
H3  4.45,97.16 0 top
H6  4.45,157.48 0 top
H7  4.45,88.26 0 top
H8  4.45,27.3 0 top
H9  29.21,3.81 0 top
H10  3.81,3.94 0 top
IC1  11.43,149.22 180 top
IC2  16.51,103.5 0 top
IC3  6.99,127.63 0 top
IC4  19.05,115.57 270 top
IC5  28.57,135.25 180 top
IC6  24.13,27.94 0 top
IC7  20.95,40.64 0 top
IC8  8.89,43.18 180 top
IC9  8.89,34.92 270 top
IC10  14.61,61.59 180 top
IC11  8.26,50.16 0 top
IC12  3.81,50.16 0 top
IC13  12.06,50.16 180 top
IC14  24.77,55.88 0 top
IC15  24.77,70.48 0 top
IC16  5.71,76.83 0 top
LED1  22.23,49.53 0 top
LED2  20.32,76.83 270 top
LED3  20.32,74.93 90 top
LED4  2.54,61.59 270 top
LED5  8.89,61.59 270 top
LED6  32,73.02 0 top
PT1  27.94,27.94 180 bottom
Q1  20.32,151.13 180 top
Q2  23.5,147.32 180 top
Q3  23.5,151.13 0 top
Q4  20.32,147.32 0 top
Q5  12.83,111.76 270 top
Q6  9.53,67.31 90 top
R1  16.51,149.22 270 top
R2  10.79,156.59 270 top
R3  7.62,133.35 270 top
R4  3.17,127.63 90 top
R5  7.62,121.92 0 top
R6  22.86,140.97 180 top
R7  9.53,114.3 270 top
R8  15.88,122.55 0 top
R9  13.34,114.94 0 top
R10  26.67,141.48 270 top
R11  9.53,118.11 270 top
R12  12.06,125.48 180 top
R13  24.13,129.54 0 top
R14  13.34,117.47 0 top
R15  27.3,129.54 0 top
R16  27.3,127.63 0 top
R17  18.41,128.27 270 top
R18  18.41,125.09 270 top
R19  20.95,127.63 0 top
R20  25.53,117.86 270 top
R21  22.23,94.61 0 top
R22  16.51,27.94 270 top
R23  20.32,27.94 90 top
R24  24.13,33.02 0 top
R25  27.3,33.02 0 top
R26  20.32,34.92 90 top
R27  24.77,42.54 270 top
R28  17.14,40.64 90 top
R29  17.14,43.81 270 top
R30  22.23,46.35 90 top
R31  20.32,46.35 90 top
R32  17.14,76.83 0 top
R33  17.14,74.93 0 top
R34  14.61,43.18 270 top
R35  16.51,67.31 270 top
R36  16.51,70.48 270 top
R37  18.41,61.59 90 top
R38  13.97,55.88 90 top
R39  29.84,50.16 270 top
R40  1.27,58.42 270 top
R41  10.79,58.42 270 top
R42  27.94,45.72 90 top
R43  29.84,41.27 90 top
R44  5.71,61.59 180 top
R45  8.89,63.5 180 top
R46  24.13,50.16 90 top
R47  26.04,50.16 90 top
R48  5.71,65.41 0 top
R49  5.71,67.31 180 top
R50  12.7,67.31 90 top
R51  20.95,55.88 90 top
R52  5.71,70.48 90 top
R53  7.62,70.48 90 top
R54  24.13,64.77 90 top
R55  29.84,68.58 180 top
R56  11.43,76.2 180 top
R57  11.43,79.38 0 top
R58  28.57,73.02 90 top
R59  30.48,73.02 270 top
R60  25.4,76.2 90 top
R61  1.91,76.83 90 top
R62  3.17,120.65 180 top
S1  15.88,107.95 90 top
T1  19.68,121.28 270 top
T2  3.81,58.42 180 top
T3  8.26,58.42 0 top
TP1  4.06,114.55 270 top
TP2  10.79,26.67 0 top
X1  2.54,107.95 0 bottom
X2  23.5,88.26 0 top
X3  16.51,4.44 180 top
X4  16.51,16.51 180 top

### Tracks (layer width: path | path; a pad name or v marks a point on that pad's centre or on a via)
+5V  (via drill 0.35)
  Top 0.406: C13.1 23.24,116.97 22.73,117.47 IC4.8 v19.94,117.47
  Bottom 0.406: v19.94,117.47 v19.94,111.76
  pour Top: 0.64,93.34 0.64,145.41 7.62,145.41 32.38,146.05 32.38,93.34
A
  Top 0.406: IC12.4 4.29,51.46 3.81,51.94 D10.C
AGND  (via drill 0.35)
  Top 0.406: v29.21,33.02 R25.2 | IC6.3 v24.77,27.3 | IC6.4 v26.04,27.3 | C21.1 C19.1 C18.2 | C21.1 v8.89,85.34 | 18.67,27.05 C17.2 v18.41,24.77 | IC7.1 v19.05,36.45 | v22.86,36.45 IC7.4 22.92,38.1 23.5,38.1 23.81,37.78 D9.2 | v6.35,33.65 6.67,33.97 IC9.3 7.6,33.04 8,32.64 C27.2 | IC8.7 v5.08,44.45 | IC12.3 4.76,50.1 v4.7,50.16 | IC11.3 9.21,50.1 v9.14,50.16 | IC13.3 11.12,50.23 v11.18,50.16 | C28.2 v12.7,34.92 | C29.2 v1.91,55.88 | C30.2 v6.35,55.88 | LED5.C 10.67,61.59 | 10.67,61.59 v10.79,61.59 R41.1 | R45.1 9.78,62.74 10.79,61.72 10.67,61.59 | C33.2 v14.61,52.07 | R53.1 8.51,69.6 8.57,69.53 D16.2 10.86,69.53 v11.05,69.34 | IC16.5 v7.62,77.85 7.71,77.94 10.16,77.94 | IC16.2 v5.08,75.82 | C22.1 v14.61,69.34 | v12.7,62.48 IC10.4 R50.1 | R57.2 11.43,80.01 10.16,78.74 10.16,77.94 | 10.16,77.94 R57.1 | R38.1 C36.2 v16.51,53.97 | IC14.3 v25.4,55.24 | C32.2 v27.94,48.26 | C31.1 v22.23,63.5 | LED1.C v22.23,51.18 | LED6.C v32,74.93 | IC15.3 v25.4,69.47 | D12.1 31.43,48.83 v31.5,48.89 | R43.1 31.3,39.04 31.11,38.86 v31.11,38.73 | C35.2 v28.07,63.88 | C15.2 C16.2 v17.14,30.23 | C37.2 v1.91,82.55 | C20.2 C21.1 | LED3.A LED2.C 21.72,76.83 21.97,77.09 C34.1 v22.86,78.1 | v10.16,24.77 10.16,26.67 TP2.P$1 11.43,26.67 v11.43,24.77
  pour Bottom: 0.64,23.49 0.64,92.07 33.66,92.07 33.66,23.49
ANALOG_OUT
  Bottom 0.406: X4.2 19.05,11.31 X3.4
AOUT
  Top 0.406: R60.2 25.4,78.1 X2.4
B
  Top 0.406: IC11.4 8.61,51.46 8.26,51.82 D11.A
C
  Top 0.406: D13.C 4.46,71.73 4.83,71.37 R52.2 R53.2 | R53.2 8.38,71.37 8.44,71.44 D16.1 15.56,71.44 15.62,71.37 R36.1 | R53.2 IC16.4
FOUT  (via drill 0.35)
  Top 0.406: R31.2 v20.32,48.26 | IC8.11 v8.89,38.1
  Bottom 0.406: v8.89,38.1 19.05,48.26 v20.32,48.26 20.32,78.1 X2.6
FREQ_OUT
  Bottom 0.406: X4.4 13.97,10.29 X3.6
GND  (via drill 0.2 pad 0.38, 0.35)
  Top 0.305: IC1.4 v9.53,148.21
  Top 0.406: IC4.4 v18.16,113.66 | C1.2 C2.2 v20.95,100.96 | v12.06,100.96 C3.2 C4.2 14.86,102.62 15.12,102.35 IC2.1 IC2.2 | R13.1 C6.1 v23.24,126.36 | IC5.2 IC5.1 v30.48,135.89 | v8.89,127 IC3.4 8.89,123.7 8.51,123.32 R5.2 | v23.75,119.76 C13.2 | R7.2 v9.53,112.39 | TP1.P$1 4.06,113.79 | v6.1,115.32 4.06,115.32 TP1.P$1 | v5.08,135.25 C12.2 | C11.2 v12.06,141.6 | C5.2 v28.19,143.51 | C9.2 v15.24,119.38 | v18.41,119.38 18.59,119.55 T1.2 D4.2 | D5.A 17.16,123.84 17.53,124.21 R18.2 v19.68,124.21 | D2.1 7.79,145.25 v7.62,145.41 | D1.1 9.74,138.89 v9.91,139.06 | C10.2 v26.8,113.54 | TP1.P$1 4.83,113.79 v6.1,113.79
  pour Bottom: 0.64,93.34 0.64,161.93 7.62,161.93 7.62,148.59 32.38,148.59 32.38,93.34
HV_IN
  Top 0.61: R2.1 H1.B3,0 R1.1 16.71,152.23 Q1.2 Q1.1 Q3.3 25.57,152.23 26.54,151.26 GDT1.P$1
HV_IN1
  Top 0.406: Q3.1 Q2.2 | Q3.1 Q3.2 | Q1.3 Q3.1 | Q4.3 Q2.2 | Q2.2 Q2.1
HV_OUT  (via drill 0.35)
  Top 0.406: D1.3 R3.1 | 7.66,136.65 v16.51,136.65
  Top 0.61: GDT1.P$2 27.3,147.19 26.29,146.18 23.54,146.18 Q2.3 Q4.2 Q4.1 16.71,146.22 R1.2 v16.51,136.65 | D1.3 7.66,136.65
  Bottom 0.61: v16.51,136.65 H2.B3,0
HYST
  Top 0.406: IC5.5 26.67,130.81 26.42,130.56 R15.1 R13.2
N$1
  Top 0.406: LED2.A R32.2
N$2  (via drill 0.35)
  Top 0.406: R14.1 C9.1 v11.18,119.38 | Q5.1 11.73,113.37 v11.18,113.92 | IC5.7 v29.21,135.25 | v18.41,135.25 v11.18,135.25
  Bottom 0.406: v11.18,113.92 v11.18,119.38 v11.18,135.25 | v29.21,135.25 v18.41,135.25
N$3
  Top 0.406: R21.2 27.43,94.61 27.94,95.12 D8.P$1
N$4
  Top 0.406: C14.1 R22.1 16.51,28.19 16.76,27.94 23.11,27.94 23.5,27.56 | 23.5,27.56 IC6.2 | PT1.P3 26.42,28.19 24.13,28.19 23.5,27.56
N$5  (via drill 0.35)
  Top 0.406: IC6.1 21.4,25.34 20.83,25.91 v20.32,25.91 R23.1 | C14.2 R22.2 v16.51,25.91
  Bottom 0.406: v20.32,25.91 v16.51,25.91
N$6
  Top 0.406: R6.2 22.86,140.33 24.11,141.58 R6.1 26.62,142.42 R10.1
N$7
  Top 0.61: IC1.3 10.79,153.03 10.95,153.19 10.95,154.66 10.79,154.81 R2.2
N$8
  Top 0.406: C17.1 R23.2 25.53,28.83 26.04,29.34 IC6.5
N$9
  Top 0.406: R16.1 C6.2
N$10  (via drill 0.35)
  Top 0.406: T1.3 20.79,121.88 21.14,122.23 D4.1 23.43,122.23 v25.02,123.82 | C5.1 R10.2 IC5.4 25.84,137.85 25.02,137.03 v25.02,131.44
  Bottom 0.406: v25.02,131.44 v25.02,123.82
N$11
  Top 0.406: C7.1 D4.3
N$12
  Top 0.406: T1.1 17.72,122.23 17.4,122.55 R8.2
N$13
  Top 0.406: D3.A R8.1 14.99,121.16 19.94,116.2 IC4.7
N$14
  Top 0.406: R19.1 19.81,127.38 R17.2 R18.1
N$15  (via drill 0.35)
  Top 0.406: D3.C D5.C 16.51,128.78 16.89,129.16 R17.1 19.05,129.16 19.43,129.54 C8.1 v20.07,136.27 | IC5.3 v27.94,136.27
  Bottom 0.406: v27.94,136.27 v20.07,136.27
N$16
  Top 0.406: IC4.6 22.86,114.94 23.6,115.68 D7.A 24.53,115.68 24.89,115.32 C10.1 R20.2
N$17
  Top 0.406: IC6.6 24.77,32 25.02,32.26 R24.2 R25.1
N$18
  Top 0.406: IC4.1 R14.2 13.59,117.47 13.34,117.73 13.34,121.03 13.02,121.35 D6.1
N$19
  Top 0.406: R12.2 11.18,123.46 D6.2 11.12,121.99 9.53,120.4 R11.1
N$20
  Top 0.406: R11.2 9.53,116.2 | 9.53,116.2 R7.1 | IC4.2 9.53,116.2
N$21
  Top 0.406: IC6.7 23.5,32 23.24,32.26 R24.1 22.35,33.02 21.34,34.04 R26.1
N$22
  Top 0.406: IC2.4 18.15,104.66 18.41,104.39 C1.1 C2.1 20.95,107.37 S1.1
N$23
  Top 0.406: D6.3 12.06,125.22 12.32,125.48 R12.1
N$24
  Top 0.406: R28.1 20.07,39.75 20.32,39.5 IC7.2 R26.2
N$25
  Top 0.406: IC4.3 R9.2
N$26
  Top 0.406: R27.2 24.77,40.64 24.93,40.47 D9.1 21.91,39.68 21.59,39.37 IC7.3
N$27
  Top 0.406: IC3.2 6.35,123.7 6.73,123.32 R5.1 5.84,121.92 5.66,122.1 R62.1
N$28
  Top 0.406: R3.2 IC3.6 7.62,128.91 7.24,128.52 R4.2
N$29  (via drill 0.35)
  Top 0.406: IC9.4 11.08,33.97 11.43,34.33 IC8.13 v11.43,42.54 | v13.72,46.23 12.72,46.23 IC8.1
  Bottom 0.406: v13.72,46.23 11.43,43.94 v11.43,42.54
N$30
  Top 0.406: IC9.2 6.73,34.92 6.35,35.31 IC8.9
N$31
  Top 0.406: IC12.2 3.81,43.05 5.08,41.78 IC8.8
N$32  (via drill 0.35)
  Top 0.406: IC11.2 8.26,48.13 7.62,47.5 IC8.5 v7.62,44.2 | v7.62,37.08 7.6,37.06 IC9.1
  Bottom 0.406: v7.62,44.2 v7.62,37.08
N$33
  Top 0.406: R57.3 12.68,77.07 12.32,76.71 R56.1
N$34
  Top 0.406: R62.2 3.17,121.79 2.87,122.1 R62.3 1.91,122.12 1.91,123.82 3.17,125.09 R4.1
N$35
  Top 0.406: T2.C 4.62,57.32 5.71,58.42 | T3.3 6.82,59.52 5.71,58.42 | 5.71,58.42 5.71,63.25 5.46,63.5 C25.1 R48.1
N$36
  Top 0.406: D11.C 8.26,55.24 8.89,55.24 9.21,55.56 T3.2 9.82,57.32 10.03,57.53 R41.2
N$37
  Top 0.406: T2.B 4.83,59.59 R44.2 LED4.C
N$38
  Top 0.406: R44.1 LED5.A 8.14,61.07 8.51,60.71 8.89,60.71 9.27,60.32 9.27,58.67 9.02,58.42 7.49,58.42 7.3,58.23 T3.1
N$39
  Top 0.406: R45.2 C25.2
N$40
  Top 0.406: Q6.C R49.1
N$41
  Top 0.406: Q6.B 9.08,66.36 8.13,65.41 R48.2
N$42
  Top 0.406: R50.2 12.64,68.26 Q6.E 6.16,68.26 5.71,68.71 R52.1 4.95,69.6 4.59,69.23 D13.A
N$43
  Top 0.406: IC16.3 6.35,75.82 6.73,76.2 R56.2
N$44
  Top 0.406: C26.1 6.6,81.53 6.35,81.28 IC16.6
N$45
  Top 0.406: C26.2 4.83,81.53 5.08,81.28 IC16.7
N$46  (via drill 0.35)
  Top 0.406: IC16.1 3.81,75.69 3.56,75.95 R61.1 v1.91,74.29 | v12.06,53.34 IC13.2
  Bottom 0.406: v1.91,74.29 1.91,63.5 v12.06,53.34
N$47
  Top 0.406: R36.2 R35.1 C24.1
N$48
  Top 0.406: R35.2 C22.2 14.61,66.04 13.97,65.41 IC10.3
N$49  (via drill 0.35)
  Top 0.406: C23.2 R37.1 | R37.1 14.22,60.71 13.97,60.45 IC10.6 R38.2 | C24.2 v19.05,64.77 | R37.1 v18.41,59.05 v21.59,59.05 | R46.1 v24.13,48.26
  Bottom 0.406: v19.05,64.77 18.41,64.13 v18.41,59.05 | v21.59,59.05 24.13,56.51 v24.13,48.26
N$50
  Top 0.406: C23.1 R37.2 15.75,62.48 15.24,62.99 IC10.2
N$51
  Top 0.406: R47.2 R46.2 IC14.2 24.13,54.61 23.75,54.99 R51.1
N$52
  Top 0.406: R55.1 31.09,69.19 29.84,67.94 R55.2 29.84,65.53 29.08,64.77 24.26,64.77 24.13,64.9 R54.2 IC15.2
N$53
  Top 0.406: R59.1 R58.2 28.57,74.68 27.94,75.31 R60.1 IC15.6
N$54
  Top 0.406: R33.2 LED3.C
N$55
  Top 0.406: R51.2 25.15,56.77 25.4,57.02 IC14.6 25.4,60.32 24.13,61.59 R54.1
N$56
  Top 0.406: R39.2 29.84,48.64 29.53,48.33 D12.2 29.17,47.45 28.32,46.61 R42.2
N$57
  Top 0.406: R47.1 26.04,42.29 27.05,41.27 R43.2
N$58
  Top 0.406: R42.1 27.94,44.32 29.74,42.52 R43.3
N$59
  Top 0.406: R58.1 28.57,70.05 R55.3
N$60
  Top 0.406: D10.A 3.19,55.22 2.79,55.63 2.79,59.45 T2.E 2.24,59.52 2.03,59.31 R40.1
N$61
  Top 0.406: R30.2 LED1.A
N$62
  Top 0.406: LED6.A 31.86,72.14 R59.2
N$63  (via drill 0.35)
  Top 0.406: S1.2 8.75,107.95 B1.V+ 8.27,107.95 X1.1
  other vias: 8.51,107.71
N$69
  Top 0.406: R34.1 11.94,44.07 11.43,44.58 | 11.43,44.58 IC8.2 | IC8.4 8.89,44.58 9.4,44.07 9.65,44.07 | 9.65,44.07 10.92,44.07 11.43,44.58 | IC8.12 10.16,42.54 9.91,42.8 9.53,42.8 | 9.53,42.8 7.87,42.8 7.62,42.54 IC8.10 | 9.53,42.8 9.65,42.93 9.65,44.07
N$100
  Top 0.406: R29.2 R28.2 20.07,41.53 20.32,41.78 IC7.7 R31.1 R30.1
PE
  pour Bottom: 0.64,0.63 0.64,22.22 32.38,22.22 32.38,0.63
PLL_OUT
  Top 0.406: IC8.3 10.16,48.51 10.54,48.89 11.09,48.89 IC13.4
V+
  pour Top: 0.64,92.07 33.66,92.07 33.66,23.49 0.64,23.49
V-  (via drill 0.35)
  Top 0.406: PT1.P5 PT1.P4 | C21.2 C19.2 13.46,83.57 14.61,82.42 14.61,79.38 | C35.1 IC15.4 v26.67,69.47 26.67,69.85 26.04,70.48 19.43,70.48 16.26,73.66 R33.1 15.24,74.93 14.61,75.56 14.61,79.38 | R39.1 C32.1 27.94,52.58 27.24,53.28 IC14.4 v26.67,55.24 | X2.8 14.61,79.38
  Bottom 0.406: v26.67,69.47 v26.67,55.24 26.67,46.99 27.94,45.72 PT1.P5
VDD
  Bottom 0.406: X4.1 21.59,11.81 X3.2
VGUARD  (via drill 0.2, 0.2 pad 0.51, 0.2 pad 0.55, 0.35)
  Top 0.305: v10.16,153.67 v10.16,149.86
  Top 0.406: v25.4,147.32 23.62,147.32 v23.5,147.45 23.37,147.32 20.45,147.32 v20.32,147.19 20.19,147.32 19.3,147.32 19.05,147.57 v19.05,147.95 | v19.05,150.5 19.05,150.62 19.56,151.13 20.19,151.13 v20.32,151.26 20.45,151.13 23.37,151.13 v23.5,151 23.62,151.13 25.4,151.13 v26.04,150.5 | D2.3 9.99,143.97 10.79,144.78 IC1.6 | R6.3 20.77,142.42 v20.32,142.88
  Top 0.61: v10.16,149.86 v10.16,149.22 v10.79,149.22 | v12.06,149.22 IC1.2 v12.06,153.67 v12.7,153.67 v13.34,153.67 v13.97,153.67 14.22,153.42 v14.22,153.03 v14.22,152.4 v14.22,151.76 v14.22,151.13 v14.22,150.5 v14.22,149.86 14.22,149.22 | v10.79,149.22 IC1.6 | v12.06,149.22 v11.43,149.22 v10.79,149.22 | v12.06,149.22 v12.7,149.22 v13.34,149.22 v13.97,149.22 14.22,149.22 | 14.22,149.22 v14.61,149.22 v15.24,149.22 v15.88,149.22 v16.51,149.22 v17.14,149.22 v17.78,149.22 v18.41,149.22 v19.05,149.22 | v8.89,149.22 v8.26,149.22 v8.26,149.86 v8.26,150.5 v8.26,151.13 v8.26,151.76 v8.26,152.4 v8.26,153.03 v8.26,153.67 | v8.26,153.67 v8.26,154.31 v8.26,154.94 v8.26,155.57 v8.26,156.21 v8.26,156.84 v8.26,157.48 v8.26,158.12 v8.26,158.75 v8.26,159.38 v8.26,160.02 v8.26,160.65 v8.26,161.29 v8.26,161.93 v8.89,161.93 v9.53,161.93 v10.16,161.93 v10.79,161.93 v11.43,161.93 v12.06,161.93 v12.7,161.93 v13.34,161.93 v13.97,161.93 v14.61,161.93 v15.24,161.93 v15.88,161.93 v16.51,161.93 v17.14,161.93 v17.78,161.93 v18.41,161.93 v19.05,161.93 v19.68,161.93 v20.32,161.93 v20.95,161.93 v21.59,161.93 v22.23,161.93 v22.86,161.93 v23.5,161.93 v24.13,161.93 v24.77,161.93 v25.4,161.93 v26.04,161.93 v26.67,161.93 v27.3,161.93 v27.94,161.93 v28.57,161.93 v29.21,161.93 v29.84,161.93 v30.48,161.93 v31.11,161.93 v31.75,161.93 v32.38,161.93 v32.38,161.29 v32.38,160.65 v32.38,160.02 v32.38,159.38 v32.38,158.75 v32.38,158.12 v32.38,157.48 v32.38,156.84 v32.38,156.21 v32.38,155.57 v32.38,154.94 v32.38,154.31 v32.38,153.67 v32.38,153.03 v32.38,152.4 v32.38,151.76 v32.38,151.13 v32.38,150.5 v32.38,149.86 v32.38,149.22 v31.75,149.22 v31.11,149.22 v30.48,149.22 v29.84,149.22 v29.21,149.22 v28.57,149.22 v27.94,149.22 v27.3,149.22 v26.67,149.22 v26.04,149.22
  Top 0.61: v8.26,153.67 v8.89,153.67 v10.16,153.67 v9.53,153.67 | v26.04,149.22 v26.04,148.59 v26.04,147.95 v26.04,147.32 v25.4,147.32 | v19.05,149.22 v19.05,148.59 v19.05,147.95 | v19.05,149.22 v19.05,149.86 v19.05,150.5 | v26.04,150.5 v26.04,149.86 v26.04,149.22
  Bottom 0.305: v10.16,153.67 v10.16,149.86
  Bottom 0.406: v19.05,147.95 19.05,147.57 19.3,147.32 20.19,147.32 v20.32,147.19 | v20.32,147.19 20.45,147.32 23.37,147.32 v23.5,147.45 23.62,147.32 v25.4,147.32 | v26.04,150.5 25.4,151.13 23.62,151.13 v23.5,151 23.37,151.13 20.45,151.13 v20.32,151.26 20.19,151.13 19.56,151.13 19.05,150.62 v19.05,150.5 | v20.32,142.88 v20.32,147.19
  Bottom 0.61: v10.16,149.22 v8.89,149.22 v8.26,149.22 v8.26,149.86 v8.26,150.5 v8.26,151.13 v8.26,151.76 v8.26,152.4 v8.26,153.03 v8.26,153.67 | v10.16,149.22 v10.16,149.86 | v19.05,149.22 v26.04,149.22 | v8.26,153.67 v8.26,154.31 v8.26,154.94 v8.26,155.57 v8.26,156.21 v8.26,156.84 v8.26,157.48 v8.26,158.12 v8.26,158.75 v8.26,159.38 v8.26,160.02 v8.26,160.65 v8.26,161.29 v8.26,161.93 v8.89,161.93 v9.53,161.93 v10.16,161.93 v10.79,161.93 v11.43,161.93 v12.06,161.93 v12.7,161.93 v13.34,161.93 v13.97,161.93 v14.61,161.93 v15.24,161.93 v15.88,161.93 v16.51,161.93 v17.14,161.93 v17.78,161.93 v18.41,161.93 v19.05,161.93 v19.68,161.93 v20.32,161.93 v20.95,161.93 v21.59,161.93 v22.23,161.93 v22.86,161.93 v23.5,161.93 v24.13,161.93 v24.77,161.93 v25.4,161.93 v26.04,161.93 v26.67,161.93 v27.3,161.93 v27.94,161.93 v28.57,161.93 v29.21,161.93 v29.84,161.93 v30.48,161.93 v31.11,161.93 v31.75,161.93 v32.38,161.93 v32.38,161.29 v32.38,160.65 v32.38,160.02 v32.38,159.38 v32.38,158.75 v32.38,158.12 v32.38,157.48 v32.38,156.84 v32.38,156.21 v32.38,155.57 v32.38,154.94 v32.38,154.31 v32.38,153.67 v32.38,153.03 v32.38,152.4 v32.38,151.76 v32.38,151.13 v32.38,150.5 v32.38,149.86 v32.38,149.22 v31.75,149.22 v31.11,149.22 v30.48,149.22 v29.84,149.22 v29.21,149.22 v28.57,149.22 v27.94,149.22 v27.3,149.22 v26.67,149.22 v26.04,149.22 | v8.26,153.67 v8.89,153.67 v9.53,153.67 v10.16,153.67 | v10.16,149.22 v10.79,149.22 v11.43,149.22 v12.06,149.22 | v12.06,149.22 v12.06,149.86 v12.06,153.67 v12.7,153.67 v13.34,153.67 v13.97,153.67 14.22,153.42 v14.22,153.03 v14.22,152.4 v14.22,151.76 v14.22,151.13 v14.22,150.5 v14.22,149.86 14.22,149.22
  Bottom 0.61: v12.06,149.22 v12.7,149.22 v13.34,149.22 v13.97,149.22 14.22,149.22 | 14.22,149.22 v14.61,149.22 v15.24,149.22 v15.88,149.22 v16.51,149.22 v17.14,149.22 v17.78,149.22 v18.41,149.22 v19.05,149.22 | v19.05,149.22 v19.05,148.59 v19.05,147.95 | v25.4,147.32 v26.04,147.32 v26.04,147.95 v26.04,148.59 v26.04,149.22 | v19.05,149.22 v19.05,149.86 v19.05,150.5 | v26.04,149.22 v26.04,149.86 v26.04,150.5
VREF  (via drill 0.35)
  Top 0.406: IC5.6 27.94,130.81 28.19,130.56 R15.2 R16.2 28.19,125.6 27.94,125.35 v21.84,125.35 R19.2 | Q5.3 13.97,111.8 13.97,112.39 12.45,113.92 R9.1 10.92,114.94 10.29,114.3 8.26,114.3 7.62,114.94 IC3.3 | D7.C 23.48,113.18 22.99,113.66 IC4.5 | IC4.5 20.07,113.66 18.16,111.76 14.01,111.76 | v21.84,112.39 21.65,112.59 IC4.5
  Top 0.61: 14.01,111.76 Q5.3
  Bottom 0.406: v21.84,125.35 v21.84,112.39
VSS
  Bottom 0.406: X4.5 11.43,10.79 X3.8
VTOF_OUTPUT  (via drill 0.35)
  Top 0.406: 27.3,118.74 28.19,119.63 C7.2 30.48,121.28 IC5.8 v30.48,134.37 | 27.3,118.74 R20.1 | C8.2 v21.84,134.37 | D8.P$2 27.94,118.11 27.3,118.74
  Bottom 0.406: v30.48,134.37 v21.84,134.37

### Text on the board
tPlace: CCM_0020 revC / floating pico-ammeter / transmitter / N. Fitch / Feb. 2020 | slope | offset | VBAT GND | CCM_0020 revC / floating pico-ammeter / receiver / N. Fitch / Feb. 2020 | -5V FOUT GND AOUT +5V | CCM_0020 revC / floating pico-ammeter / breakout / N. Fitch / Feb. 2020
bPlace: VBAT GND